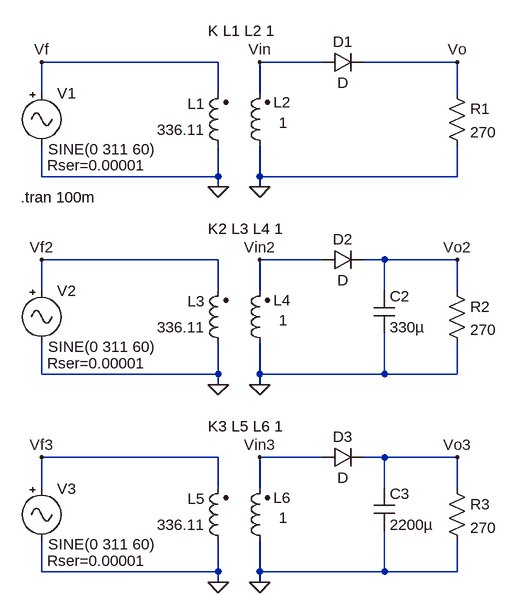
[diagram p0: schematic Draft1.asc]
Draft1.asc, the LTspice schematic file:
Version 4
SHEET 1 880 900
WIRE 368 80 96 80
WIRE 528 80 432 80
WIRE 736 80 592 80
WIRE 96 128 96 80
WIRE 368 128 368 80
WIRE 432 128 432 80
WIRE 736 128 736 80
WIRE 96 256 96 208
WIRE 368 256 368 208
WIRE 368 256 96 256
WIRE 432 256 432 208
WIRE 736 256 736 208
WIRE 736 256 432 256
WIRE 368 272 368 256
WIRE 432 272 432 256
WIRE 368 384 96 384
WIRE 528 384 432 384
WIRE 624 384 592 384
WIRE 736 384 624 384
WIRE 96 432 96 384
WIRE 368 432 368 384
WIRE 432 432 432 384
WIRE 624 432 624 384
WIRE 736 432 736 384
WIRE 96 560 96 512
WIRE 368 560 368 512
WIRE 368 560 96 560
WIRE 432 560 432 512
WIRE 624 560 624 496
WIRE 624 560 432 560
WIRE 736 560 736 512
WIRE 736 560 624 560
WIRE 368 576 368 560
WIRE 432 576 432 560
WIRE 368 688 96 688
WIRE 528 688 432 688
WIRE 624 688 592 688
WIRE 736 688 624 688
WIRE 96 736 96 688
WIRE 368 736 368 688
WIRE 432 736 432 688
WIRE 624 736 624 688
WIRE 736 736 736 688
WIRE 96 864 96 816
WIRE 368 864 368 816
WIRE 368 864 96 864
WIRE 432 864 432 816
WIRE 624 864 624 800
WIRE 624 864 432 864
WIRE 736 864 736 816
WIRE 736 864 624 864
WIRE 368 880 368 864
WIRE 432 880 432 864
FLAG 432 272 0
FLAG 368 272 0
FLAG 432 80 Vin
FLAG 96 80 Vf
FLAG 736 80 Vo
FLAG 432 576 0
FLAG 368 576 0
FLAG 432 880 0
FLAG 368 880 0
FLAG 96 384 Vf2
FLAG 432 384 Vin2
FLAG 736 384 Vo2
FLAG 96 688 Vf3
FLAG 432 688 Vin3
FLAG 736 688 Vo3
SYMBOL Misc\\signal 96 112 R0
WINDOW 3 10 102 Left 2
WINDOW 123 0 0 Left 0
WINDOW 39 9 127 Left 2
SYMATTR Value SINE(0 311 60)
SYMATTR SpiceLine Rser=0.00001
SYMATTR InstName V1
SYMBOL ind2 384 224 R180
WINDOW 0 36 80 Left 2
WINDOW 3 36 40 Left 2
SYMATTR InstName L1
SYMATTR Value 336.11
SYMATTR Type ind
SYMBOL ind2 448 224 R180
WINDOW 0 -32 82 Left 2
WINDOW 3 -27 51 Left 2
SYMATTR InstName L2
SYMATTR Value 1
SYMATTR Type ind
SYMBOL res 720 112 R0
SYMATTR InstName R1
SYMATTR Value 270
SYMBOL diode 528 96 R270
WINDOW 0 32 32 VTop 2
WINDOW 3 0 32 VBottom 2
SYMATTR InstName D1
SYMBOL Misc\\signal 96 416 R0
WINDOW 3 10 102 Left 2
WINDOW 123 0 0 Left 0
WINDOW 39 9 127 Left 2
SYMATTR Value SINE(0 311 60)
SYMATTR SpiceLine Rser=0.00001
SYMATTR InstName V2
SYMBOL ind2 384 528 R180
WINDOW 0 36 80 Left 2
WINDOW 3 36 40 Left 2
SYMATTR InstName L3
SYMATTR Value 336.11
SYMATTR Type ind
SYMBOL ind2 448 528 R180
WINDOW 0 -32 82 Left 2
WINDOW 3 -27 51 Left 2
SYMATTR InstName L4
SYMATTR Value 1
SYMATTR Type ind
SYMBOL res 720 416 R0
SYMATTR InstName R2
SYMATTR Value 270
SYMBOL diode 528 400 R270
WINDOW 0 32 32 VTop 2
WINDOW 3 0 32 VBottom 2
SYMATTR InstName D2
SYMBOL cap 608 432 R0
SYMATTR InstName C2
SYMATTR Value 330µ
SYMBOL Misc\\signal 96 720 R0
WINDOW 3 10 102 Left 2
WINDOW 123 0 0 Left 0
WINDOW 39 9 127 Left 2
SYMATTR Value SINE(0 311 60)
SYMATTR SpiceLine Rser=0.00001
SYMATTR InstName V3
SYMBOL ind2 384 832 R180
WINDOW 0 36 80 Left 2
WINDOW 3 36 40 Left 2
SYMATTR InstName L5
SYMATTR Value 336.11
SYMATTR Type ind
SYMBOL ind2 448 832 R180
WINDOW 0 -32 82 Left 2
WINDOW 3 -27 51 Left 2
SYMATTR InstName L6
SYMATTR Value 1
SYMATTR Type ind
SYMBOL res 720 720 R0
SYMATTR InstName R3
SYMATTR Value 270
SYMBOL diode 528 704 R270
WINDOW 0 32 32 VTop 2
WINDOW 3 0 32 VBottom 2
SYMATTR InstName D3
SYMBOL cap 608 736 R0
SYMATTR InstName C3
SYMATTR Value 2200µ
TEXT 352 32 Left 2 !K L1 L2 1
TEXT 64 288 Left 2 !.tran 100m
TEXT 352 336 Left 2 !K2 L3 L4 1
TEXT 352 640 Left 2 !K3 L5 L6 1

The netlist it stands for:
* Draft1.asc
V1 Vf 0 SINE(0 311 60) Rser=0.00001
L1 0 Vf 336.11
L2 0 Vin 1
R1 Vo 0 270
D1 Vin Vo D
V2 Vf2 0 SINE(0 311 60) Rser=0.00001
L3 0 Vf2 336.11
L4 0 Vin2 1
R2 Vo2 0 270
D2 Vin2 Vo2 D
C2 Vo2 0 330µ
V3 Vf3 0 SINE(0 311 60) Rser=0.00001
L5 0 Vf3 336.11
L6 0 Vin3 1
R3 Vo3 0 270
D3 Vin3 Vo3 D
C3 Vo3 0 2200µ
.model D D
.lib standard.dio
K L1 L2 1
.tran 100m
K2 L3 L4 1
K3 L5 L6 1
.backanno
.end